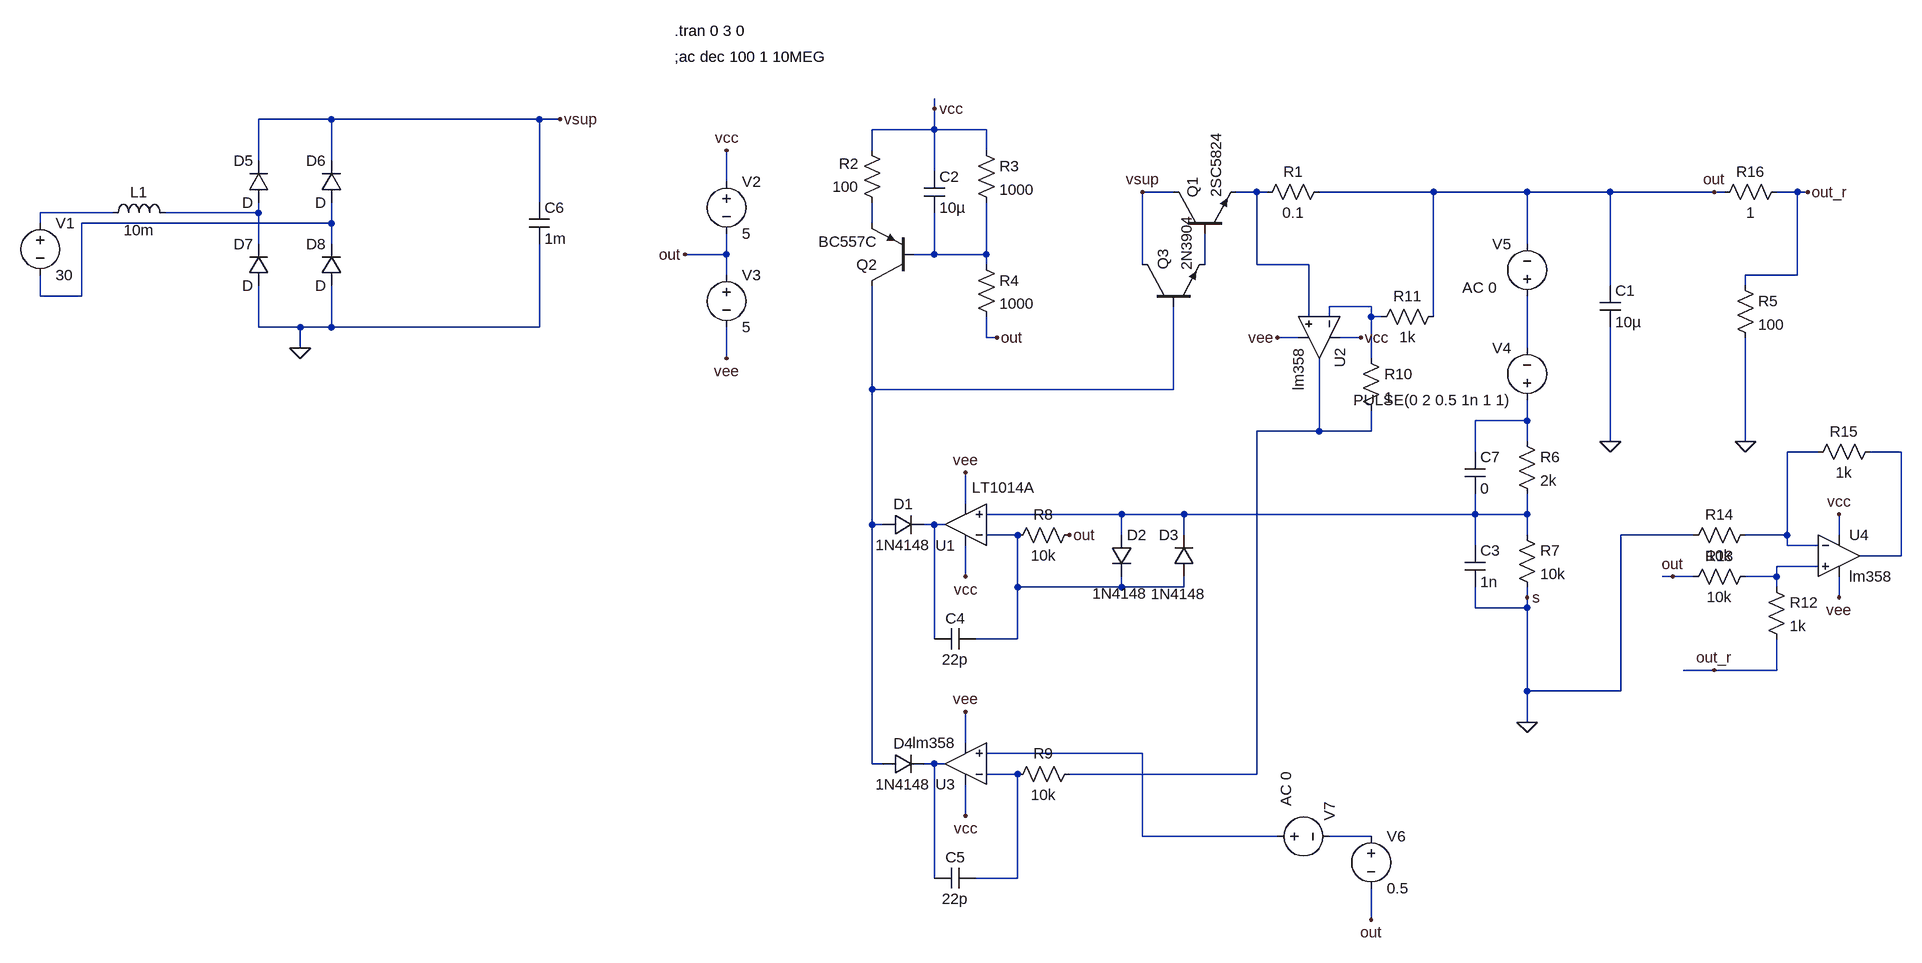
[diagram p0: schematic bode.asc]
bode.asc, the LTspice schematic file:
Version 4
SHEET 1 1316 1268
WIRE -176 -64 -176 -80
WIRE -1104 -48 -1216 -48
WIRE -784 -48 -1104 -48
WIRE -752 -48 -784 -48
WIRE -176 -32 -176 -64
WIRE -176 -32 -272 -32
WIRE -96 -32 -176 -32
WIRE -272 0 -272 -32
WIRE -96 0 -96 -32
WIRE -1216 16 -1216 -48
WIRE -1104 16 -1104 -48
WIRE -176 32 -176 -32
WIRE -496 48 -496 0
WIRE 192 64 144 64
WIRE 320 64 288 64
WIRE 336 64 320 64
WIRE 592 64 416 64
WIRE 736 64 592 64
WIRE 864 64 736 64
WIRE 1024 64 864 64
WIRE 1040 64 1024 64
WIRE 1152 64 1120 64
WIRE 1168 64 1152 64
WIRE -784 80 -784 -48
WIRE -1440 96 -1552 96
WIRE -1216 96 -1216 80
WIRE -1216 96 -1360 96
WIRE -1552 112 -1552 96
WIRE -1104 112 -1104 80
WIRE -1104 112 -1488 112
WIRE -272 112 -272 80
WIRE -1216 144 -1216 96
WIRE -1104 144 -1104 112
WIRE 736 144 736 64
WIRE -496 160 -496 128
WIRE -496 160 -560 160
WIRE -176 160 -176 96
WIRE -176 160 -208 160
WIRE -96 160 -96 80
WIRE -96 160 -176 160
WIRE -96 176 -96 160
WIRE 144 176 144 64
WIRE 240 176 240 128
WIRE 320 176 320 64
WIRE 400 176 320 176
WIRE -496 192 -496 160
WIRE 1152 192 1152 64
WIRE 1152 192 1072 192
WIRE 864 208 864 64
WIRE 1072 208 1072 192
WIRE -1552 224 -1552 192
WIRE -1488 224 -1488 112
WIRE -1488 224 -1552 224
WIRE 496 240 432 240
WIRE 400 256 400 176
WIRE 432 256 432 240
WIRE 496 256 496 240
WIRE 512 256 496 256
WIRE 592 256 592 64
WIRE -1216 272 -1216 208
WIRE -1152 272 -1216 272
WIRE -1104 272 -1104 208
WIRE -1104 272 -1152 272
WIRE -784 272 -784 144
WIRE -784 272 -1104 272
WIRE -96 288 -96 256
WIRE -80 288 -96 288
WIRE 384 288 352 288
WIRE 480 288 448 288
WIRE -1152 304 -1152 272
WIRE 736 304 736 224
WIRE -496 320 -496 272
WIRE 496 320 496 256
WIRE -272 368 -272 208
WIRE 192 368 192 240
WIRE 192 368 -272 368
WIRE 736 416 736 384
WIRE 736 416 656 416
WIRE 416 432 416 320
WIRE 416 432 320 432
WIRE 496 432 496 400
WIRE 496 432 416 432
WIRE 736 448 736 416
WIRE 864 448 864 272
WIRE 1072 448 1072 288
WIRE 656 464 656 416
WIRE 1184 464 1136 464
WIRE 1312 464 1264 464
WIRE -128 544 -128 496
WIRE 112 560 -96 560
WIRE 208 560 112 560
WIRE 656 560 656 528
WIRE 656 560 208 560
WIRE 736 560 736 528
WIRE 736 560 656 560
WIRE -272 576 -272 368
WIRE -256 576 -272 576
WIRE -176 576 -192 576
WIRE -160 576 -176 576
WIRE -48 592 -96 592
WIRE 112 592 112 560
WIRE 208 592 208 560
WIRE 736 592 736 560
WIRE 992 592 880 592
WIRE 1136 592 1136 464
WIRE 1136 592 1072 592
WIRE 1216 592 1216 560
WIRE 656 608 656 560
WIRE 1136 608 1136 592
WIRE 1184 608 1136 608
WIRE 1312 624 1312 464
WIRE 1312 624 1248 624
WIRE 1184 640 1120 640
WIRE -128 656 -128 608
WIRE 960 656 944 656
WIRE 992 656 960 656
WIRE 1120 656 1120 640
WIRE 1120 656 1072 656
WIRE -48 672 -48 592
WIRE 112 672 112 656
WIRE 112 672 -48 672
WIRE 208 672 208 656
WIRE 208 672 112 672
WIRE 1120 672 1120 656
WIRE 736 688 736 672
WIRE 1216 688 1216 656
WIRE 656 704 656 672
WIRE 736 704 736 688
WIRE 736 704 656 704
WIRE -176 752 -176 576
WIRE -48 752 -48 672
WIRE -48 752 -112 752
WIRE 1024 800 976 800
WIRE 1120 800 1120 752
WIRE 1120 800 1024 800
WIRE 736 832 736 704
WIRE 880 832 880 592
WIRE 880 832 736 832
WIRE 736 880 736 832
WIRE -128 912 -128 864
WIRE 144 928 -96 928
WIRE -272 944 -272 576
WIRE -256 944 -272 944
WIRE -176 944 -192 944
WIRE -160 944 -176 944
WIRE -48 960 -96 960
WIRE 320 960 320 432
WIRE 320 960 32 960
WIRE -128 1024 -128 976
WIRE 144 1056 144 928
WIRE 352 1056 144 1056
WIRE 496 1056 432 1056
WIRE -176 1120 -176 944
WIRE -48 1120 -48 960
WIRE -48 1120 -112 1120
WIRE 496 1184 496 1136
FLAG 1024 64 out
FLAG -80 288 out
FLAG -560 160 out
FLAG -496 320 vee
FLAG -496 0 vcc
FLAG -176 -64 vcc
FLAG 864 448 0
FLAG 1072 448 0
FLAG -128 656 vcc
FLAG -128 496 vee
FLAG 736 880 0
FLAG 32 592 out
FLAG 736 688 s
FLAG -128 1024 vcc
FLAG -128 864 vee
FLAG 496 1184 out
FLAG 144 64 vsup
FLAG -752 -48 vsup
FLAG -1152 304 0
FLAG 480 288 vcc
FLAG 352 288 vee
FLAG 1216 560 vcc
FLAG 1216 688 vee
FLAG 960 656 out
FLAG 1024 800 out_r
FLAG 1168 64 out_r
SYMBOL npn 192 128 R270
WINDOW 0 55 29 Left 2
WINDOW 3 56 65 Left 2
SYMATTR InstName Q1
SYMATTR Value 2SC5824
SYMBOL res 432 48 R90
WINDOW 0 0 56 VBottom 2
WINDOW 3 32 56 VTop 2
SYMATTR InstName R1
SYMATTR Value 0.1
SYMBOL res -256 96 R180
WINDOW 0 36 76 Left 2
WINDOW 3 36 40 Left 2
SYMATTR InstName R2
SYMATTR Value 100
SYMBOL pnp -208 208 R180
SYMATTR InstName Q2
SYMATTR Value BC557C
SYMBOL res -112 -16 R0
SYMATTR InstName R3
SYMATTR Value 1000
SYMBOL res -112 160 R0
SYMATTR InstName R4
SYMATTR Value 1000
SYMBOL voltage -496 32 R0
WINDOW 123 0 0 Left 0
WINDOW 39 0 0 Left 0
SYMATTR InstName V2
SYMATTR Value 5
SYMBOL voltage -496 176 R0
WINDOW 123 0 0 Left 0
WINDOW 39 0 0 Left 0
SYMATTR InstName V3
SYMATTR Value 5
SYMBOL res 1056 192 R0
SYMATTR InstName R5
SYMATTR Value 100
SYMBOL cap 848 208 R0
SYMATTR InstName C1
SYMATTR Value 10µ
SYMATTR SpiceLine Rser=2
SYMBOL diode -256 592 R270
WINDOW 0 32 32 VTop 2
WINDOW 3 0 32 VBottom 2
SYMATTR InstName D1
SYMATTR Value 1N4148
SYMBOL voltage 736 400 R180
WINDOW 0 24 96 Left 2
WINDOW 3 24 16 Left 2
WINDOW 123 0 0 Left 0
WINDOW 39 0 0 Left 0
SYMATTR InstName V4
SYMATTR Value PULSE(0 2 0.5 1n 1 1)
SYMBOL res 720 432 R0
SYMATTR InstName R6
SYMATTR Value 2k
SYMBOL res 720 576 R0
SYMATTR InstName R7
SYMATTR Value 10k
SYMBOL cap -192 32 R0
SYMATTR InstName C2
SYMATTR Value 10µ
SYMATTR SpiceLine Rser=2
SYMBOL cap 640 608 R0
SYMATTR InstName C3
SYMATTR Value 1n
SYMBOL cap -112 736 R90
WINDOW 0 0 32 VBottom 2
WINDOW 3 32 32 VTop 2
SYMATTR InstName C4
SYMATTR Value 22p
SYMATTR SpiceLine Rser=1
SYMBOL voltage 736 240 R180
WINDOW 0 24 96 Left 2
WINDOW 3 46 1 Left 2
WINDOW 123 46 29 Left 2
WINDOW 39 0 0 Left 0
SYMATTR InstName V5
SYMATTR Value ""
SYMATTR Value2 AC 0
SYMBOL diode 96 592 R0
WINDOW 3 61 91 Left 2
SYMATTR Value 1N4148
SYMATTR InstName D2
SYMBOL diode 224 656 R180
WINDOW 0 24 64 Left 2
WINDOW 3 72 -26 Left 2
SYMATTR InstName D3
SYMATTR Value 1N4148
SYMBOL res 48 576 R90
WINDOW 0 0 56 VBottom 2
WINDOW 3 32 56 VTop 2
SYMATTR InstName R8
SYMATTR Value 10k
SYMBOL diode -256 960 R270
WINDOW 0 32 32 VTop 2
WINDOW 3 0 32 VBottom 2
SYMATTR InstName D4
SYMATTR Value 1N4148
SYMBOL cap -112 1104 R90
WINDOW 0 0 32 VBottom 2
WINDOW 3 32 32 VTop 2
SYMATTR InstName C5
SYMATTR Value 22p
SYMATTR SpiceLine Rser=1
SYMBOL res 48 944 R90
WINDOW 0 0 56 VBottom 2
WINDOW 3 32 56 VTop 2
SYMATTR InstName R9
SYMATTR Value 10k
SYMBOL voltage 496 1040 R0
WINDOW 123 0 0 Left 0
WINDOW 39 0 0 Left 0
SYMATTR InstName V6
SYMATTR Value 0.5
SYMBOL npn 144 240 R270
SYMATTR InstName Q3
SYMATTR Value 2N3904
SYMBOL voltage -1552 96 R0
WINDOW 123 0 0 Left 0
WINDOW 39 0 0 Left 0
SYMATTR InstName V1
SYMATTR Value 30
SYMBOL diode -1200 80 R180
WINDOW 0 24 64 Left 2
WINDOW 3 24 0 Left 2
SYMATTR InstName D5
SYMBOL diode -1088 80 R180
WINDOW 0 24 64 Left 2
WINDOW 3 24 0 Left 2
SYMATTR InstName D6
SYMBOL diode -1200 208 R180
WINDOW 0 24 64 Left 2
WINDOW 3 24 0 Left 2
SYMATTR InstName D7
SYMBOL diode -1088 208 R180
WINDOW 0 24 64 Left 2
WINDOW 3 24 0 Left 2
SYMATTR InstName D8
SYMBOL cap -800 80 R0
SYMATTR InstName C6
SYMATTR Value 1m
SYMATTR SpiceLine Rser=1m
SYMBOL ind -1456 112 R270
WINDOW 0 32 56 VTop 2
WINDOW 3 5 56 VBottom 2
SYMATTR InstName L1
SYMATTR Value 10m
SYMATTR SpiceLine Rser=10m
SYMBOL OpAmps\\LT1014A -128 640 R180
WINDOW 3 -108 121 Left 2
SYMATTR InstName U1
SYMBOL cap 640 464 R0
SYMATTR InstName C7
SYMATTR Value 0
SYMBOL voltage 336 1056 R270
WINDOW 0 24 96 Left 2
WINDOW 3 46 1 Left 2
WINDOW 123 46 29 Left 2
WINDOW 39 0 0 Left 0
SYMATTR InstName V7
SYMATTR Value ""
SYMATTR Value2 AC 0
SYMBOL lm358 -128 1008 R180
SYMATTR InstName U3
SYMBOL lm358 480 288 R90
SYMATTR InstName U2
SYMBOL res 480 304 R0
SYMATTR InstName R10
SYMATTR Value 1
SYMBOL res 608 240 R90
WINDOW 0 0 56 VBottom 2
WINDOW 3 32 56 VTop 2
SYMATTR InstName R11
SYMATTR Value 1k
SYMBOL lm358 1216 560 R0
SYMATTR InstName U4
SYMBOL res 1104 656 R0
SYMATTR InstName R12
SYMATTR Value 1k
SYMBOL res 1088 640 R90
WINDOW 0 0 56 VBottom 2
WINDOW 3 32 56 VTop 2
SYMATTR InstName R13
SYMATTR Value 10k
SYMBOL res 1088 576 R90
WINDOW 0 0 56 VBottom 2
WINDOW 3 32 56 VTop 2
SYMATTR InstName R14
SYMATTR Value 10k
SYMBOL res 1280 448 R90
WINDOW 0 0 56 VBottom 2
WINDOW 3 32 56 VTop 2
SYMATTR InstName R15
SYMATTR Value 1k
SYMBOL res 1136 48 R90
WINDOW 0 0 56 VBottom 2
WINDOW 3 32 56 VTop 2
SYMATTR InstName R16
SYMATTR Value 1
TEXT -576 -144 Left 2 !;ac dec 100 1 10MEG
TEXT -576 -184 Left 2 !.tran 0 3 0

The netlist it stands for:
* bode.asc
Q1 vsup N007 N001 0 2SC5824
R1 out N001 0.1
R2 N005 vcc 100
Q2 N010 N006 N005 0 BC557C
R3 vcc N006 1000
R4 N006 out 1000
V2 vcc out 5
V3 out vee 5
R5 out_r 0 100
C1 out 0 10µ Rser=2
D1 N010 N016 1N4148
V4 N011 N009 PULSE(0 2 0.5 1n 1 1)
R6 N011 N015 2k
R7 N015 0 10k
C2 vcc N006 10µ Rser=2
C3 N015 0 1n
C4 N017 N016 22p Rser=1
V5 N009 out AC 0
D2 N015 N017 1N4148
D3 N017 N015 1N4148
R8 out N017 10k
D4 N010 N020 1N4148
C5 N021 N020 22p Rser=1
R9 N012 N021 10k
V6 N022 out 0.5
Q3 vsup N010 N007 0 2N3904
V1 N002 N004 30
D5 N003 vsup D
D6 N004 vsup D
D7 0 N003 D
D8 0 N004 D
C6 vsup 0 1m Rser=1m
L1 N002 N003 10m Rser=10m
XU1 N015 N017 vcc vee N016 LT1014A  ; pins In+ In- V+ V- OUT
C7 N011 N015 0
V7 N019 N022 AC 0
* U3: lm358 (symbol lm358 not available, pins judged from their places): In+=N019 In-=N021 V+=vcc V-=vee OUT=N020
* U2: lm358 (symbol lm358 not available, pins judged from their places): In+=N001 In-=N008 V+=vcc V-=vee OUT=N012
R10 N008 N012 1
R11 out N008 1k
* U4: lm358 (symbol lm358 not available, pins judged from their places): In+=N018 In-=N013 V+=vcc V-=vee OUT=N014
R12 N018 out_r 1k
R13 N018 out 10k
R14 N013 0 10k
R15 N014 N013 1k
R16 out_r out 1
.model D D
.lib standard.dio
.model NPN NPN
.model PNP PNP
.lib standard.bjt
;ac dec 100 1 10MEG
.tran 0 3 0
.backanno
.end